# EAGLE schematic l293d (EAGLE 7.6.0)
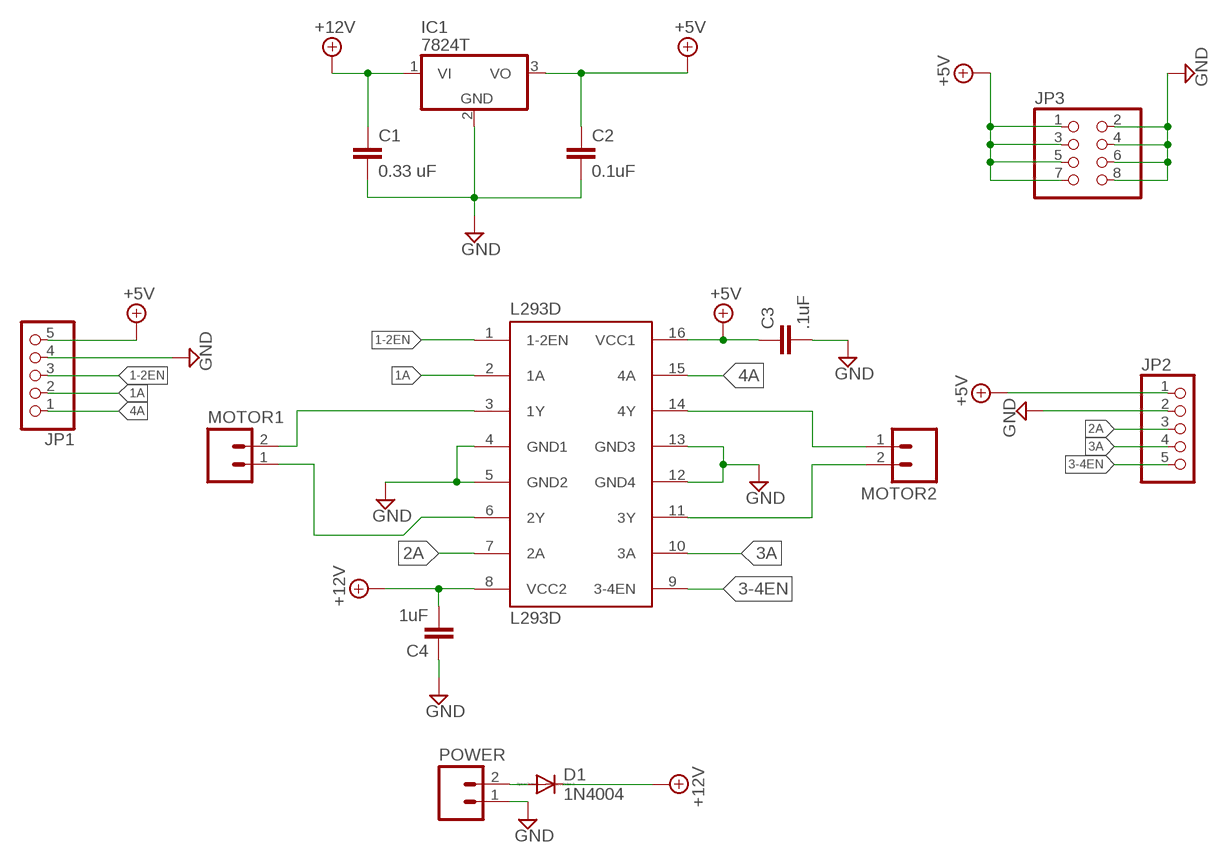
[diagram p0: schematic, sheet 1]

## Parts
C1  0.33 uF  C-EU050-024X044  [C050-024X044]
C2  0.1uF  C-EU050-024X044  [C050-024X044]
C3  .1uF  C-EU050-024X044  [C050-024X044]
C4  1uF  C-EU050-024X044  [C050-024X044]
D1  1N4004  [DO41-10]
IC1  7824T  [TO220H]
JP1  PINHD-1X5  [1X05]
JP2  PINHD-1X5  [1X05]
JP3  PINHD-2X4  [2X04]
L293D  L293D  [DIL16]
MOTOR1  M023.5MM-NO_SILK  [SCREWTERMINAL-3.5MM-2-NS]
MOTOR2  M023.5MM-NO_SILK  [SCREWTERMINAL-3.5MM-2-NS]
POWER  M023.5MM-NO_SILK  [SCREWTERMINAL-3.5MM-2-NS]

## Nets
1-2EN: JP1.3 L293D.1(1-2EN)
1A: JP1.2 L293D.2(1A)
2A: JP2.3 L293D.7(2A)
3-4EN: JP2.5 L293D.9(3-4EN)
3A: JP2.4 L293D.10(3A)
4A: JP1.1 L293D.15(4A)
+5V: C2.1 C3.1 IC1.3(VO) JP1.5 JP2.1 JP3.1 JP3.3 JP3.5 JP3.7 L293D.16(VCC1)
+12V: C1.1 C4.2 D1.C IC1.1(VI) L293D.8(VCC2)
GND: C1.2 C2.2 C3.2 C4.1 IC1.2(GND) JP1.4 JP2.2 JP3.2 JP3.4 JP3.6 JP3.8 L293D.4(GND1) L293D.5(GND2) L293D.12(GND4) L293D.13(GND3) POWER.1
N$1: L293D.14(4Y) MOTOR2.1
N$2: L293D.3(1Y) MOTOR1.2
N$3: L293D.6(2Y) MOTOR1.1
N$4: L293D.11(3Y) MOTOR2.2
N$6: D1.A POWER.2

## Library data of the parts
C1-C4 = resistor:C-EU: CAPACITOR, European symbol
D1 = diode:1N4004: DIODE general purpose rectifier, 1 A
IC1 = linear:78*: Positive VOLTAGE REGULATOR Source: http://cache.national.com/ds/LM/LM78L05.pdf http://www.fairchildsemi.com/ds/LM/LM7805.pdf
JP1 JP2 = pinhead:PINHD-1X5: PIN HEADER
JP3 = pinhead:PINHD-2X4: PIN HEADER
L293D = st-microelectronics:L293D: PUSH-PULL 4 CHANNEL DRIVER; MPN: L293D; OC_FARNELL: 9589619; OC_NEWARK: 56P8249
MOTOR1 MOTOR2 POWER = SparkFun-Connectors:M02: Standard 2-pin 0.1" header. Use with - straight break away headers ( PRT-00116) - right angle break away headers (PRT-00553) - swiss pins (PRT-00743) - machine pins (PRT-00117) - female headers (PRT-00115) Molex polarized connector foot print use with: PRT-08233 with associated crimp pins and housings. 2.54_SCREWTERM for use with PRT-10571. 3.5mm Screw Terminal footprints for PRT-08084 5mm Screw Terminal footprints for use with PRT-08432; PROD_ID: CONN-08399